# EAGLE schematic Master section (EAGLE 9.6.2)
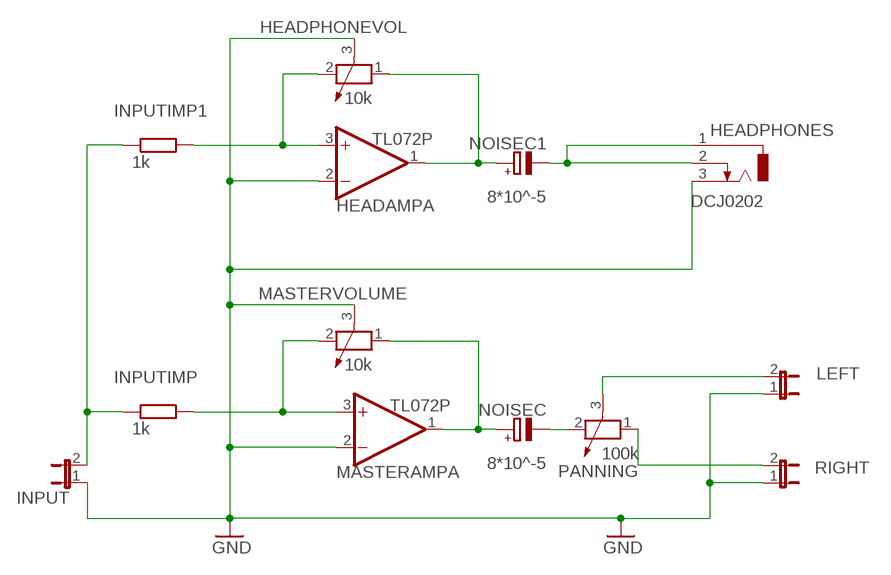
[diagram p0: schematic, sheet 1]

## Parts
HEADAMP  TL072P  [DIL08]
HEADPHONES  DCJ0202  [DCJ0202]
HEADPHONEVOL  10k  POTENTIOMETER_PT-10  [PT-10]
INPUT  JP1E  [JP1]
INPUTIMP  1k  R-EU_0207/7  [0207/7]
INPUTIMP1  1k  R-EU_0207/7  [0207/7]
LEFT  JP1E  [JP1]
MASTERAMP  TL072P  [DIL08]
MASTERVOLUME  10k  POTENTIOMETER_PT-10  [PT-10]
NOISEC  8*10^-5  CPOL-EUE5-5  [E5-5]
NOISEC1  8*10^-5  CPOL-EUE5-5  [E5-5]
PANNING  100k  POTENTIOMETER_PT-10  [PT-10]
RIGHT  JP1E  [JP1]

## Nets
GND: HEADAMP.2(A:-IN) HEADPHONES.3 HEADPHONEVOL.3 INPUT.1 LEFT.1 MASTERAMP.2(A:-IN) MASTERVOLUME.3 RIGHT.1
N$1: MASTERAMP.1(A:OUT) MASTERVOLUME.1 NOISEC.+
N$2: INPUTIMP.2 MASTERAMP.3(A:+IN) MASTERVOLUME.2
N$3: LEFT.2 PANNING.3
N$4: PANNING.1 RIGHT.2
N$5: NOISEC.- PANNING.2
N$6: INPUT.2 INPUTIMP1.1 INPUTIMP.1
N$7: HEADAMP.1(A:OUT) HEADPHONEVOL.1 NOISEC1.+
N$8: HEADAMP.3(A:+IN) HEADPHONEVOL.2 INPUTIMP1.2
N$9: HEADPHONES.1 HEADPHONES.2 NOISEC1.-
Unconnected: HEADAMP.5(B:+IN) HEADAMP.6(B:-IN) HEADAMP.7(B:OUT) MASTERAMP.5(B:+IN) MASTERAMP.6(B:-IN) MASTERAMP.7(B:OUT)

## Power pins joined to a net without a drawn wire
V+: HEADAMP.8(P:V+) MASTERAMP.8(P:V+)
V-: HEADAMP.4(P:V-) MASTERAMP.4(P:V-)

## Library data of the parts
HEADAMP MASTERAMP = linear:TL072: OP AMP
HEADPHONES = con-jack:DCJ0202: DC POWER JACK Source: DCJ0202.pdf; OC_FARNELL: unknown; OC_NEWARK: unknown
HEADPHONEVOL MASTERVOLUME PANNING = rcl:POTENTIOMETER_: Potentiometer; SPICEMODEL: POT; SPICEPREFIX: X
INPUT LEFT RIGHT = jumper:JP1E: JUMPER
INPUTIMP INPUTIMP1 = rcl:R-EU_: RESISTOR, European symbol; SPICEPREFIX: R
NOISEC NOISEC1 = rcl:CPOL-EU: POLARIZED CAPACITOR, European symbol; SPICEPREFIX: C